# Altium schematic sheet motherboard.schdoc
size 309 x 223 mm; Symbol: Sheet-Symbol_A4; Device: Sheet-Symbol_A4; @Page Name: P1; @Create Date: 2022-10-26; @Page Count: 1; @Page No: 1; @Project Name: CO21; @Schematic Name: Schematic2; @Update Date: 2022-11-01; Company: 大连佳显-辉哥; Page Size: A4; Version: V1.0
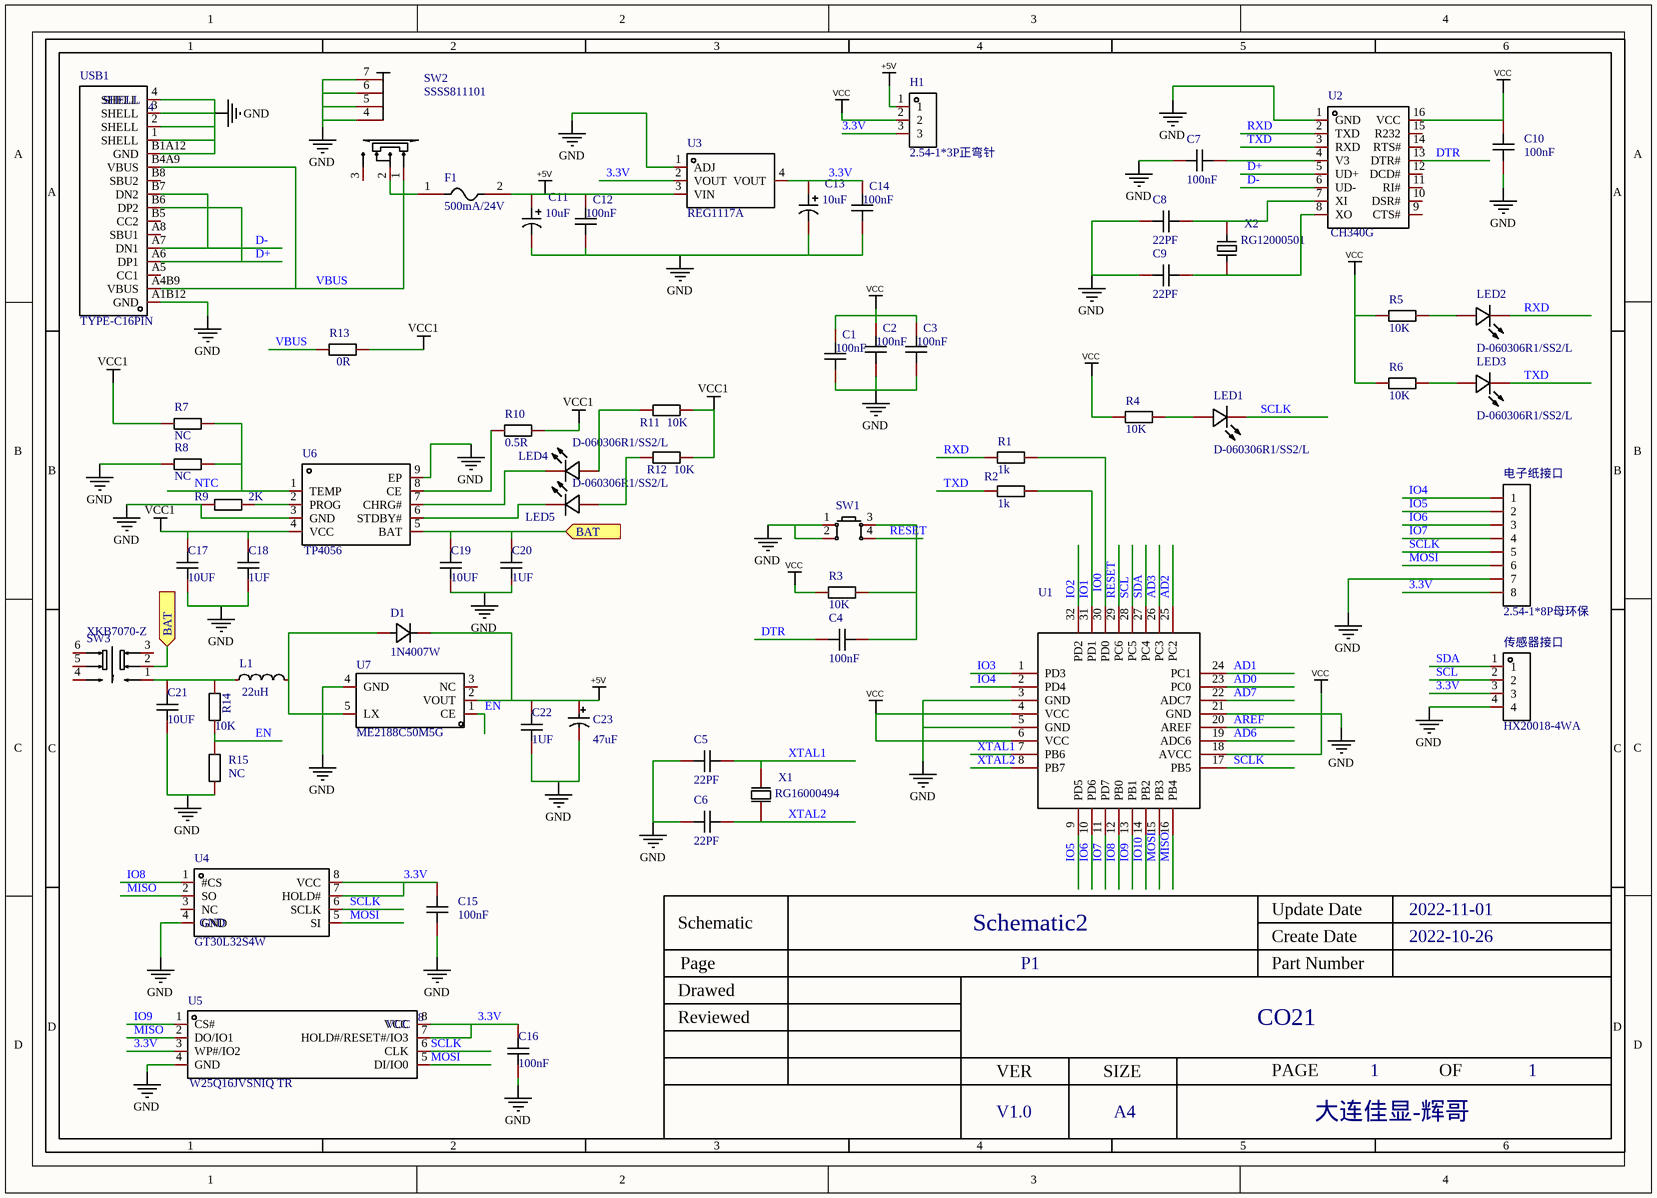
[diagram p0: motherboard.schdoc]

## Parts
C1  100nF  [C0603]
C2  100nF  [C0603]
C3  100nF  [C0603]
C4  100nF  [C0603]
C5  22PF  [C0603]
C6  22PF  [C0603]
C7  100nF  [C0603]
C8  22PF  [C0603]
C9  22PF  [C0603]
C10  100nF  [C0603]
C11  10uF  [CAP-SMD_L3.5-W2.8-FD]
C12  100nF  [C0603]
C13  10uF  [CAP-SMD_L3.5-W2.8-FD]
C14  100nF  [C0603]
C15  100nF  [C0603]
C16  100nF  [C0603]
C17  10UF  [C0603]
C18  1UF  [C0603]
C19  10UF  [C0603]
C20  1UF  [C0603]
C21  10UF  [C0603]
C22  1UF  [C0603]
C23  47uF  [CAP-TH_BD4.0-P1.50-D0.8-FD]
D1  1N4007W  [SOD-123FL_L3.0-W1.8-LS3.7-RD]
F1  500mA/24V  [F1206]
H1  2.54-1*3P正弯针  [HDR-TH_3P-P2.54-H-M-BW7.2-P]
L1  22uH  [IND-SMD_L5.0-W5.0-P3.60_SMNR5040]
LED1  D-060306R1/SS2/L  [LED0603-RD]
LED2  D-060306R1/SS2/L  [LED0603-RD]
LED3  D-060306R1/SS2/L  [LED0603-RD]
LED4  D-060306R1/SS2/L  [LED0603-RD]
LED5  D-060306R1/SS2/L  [LED0603-RD]
R1  1k  [R0603]
R2  1k  [R0603]
R3  10K  [R0603]
R4  10K  [R0603]
R5  10K  [R0603]
R6  10K  [R0603]
R7  NC  [R0603]
R8  NC  [R0603]
R9  2K  [R0603]
R10  0.5R  [R0603]
R11  10K  [R0603]
R12  10K  [R0603]
R13  0R  [R0603]
R14  10K  [R0603]
R15  NC  [R0603]
SW1  Key_SMD_6x6x6.5  [SW-SMD_4P-L6.0-W6.0-P4.50-LS9.0-2]  (value not drawn)
SW2  SSSS811101  [SW-SMD_SSSS811101]
SW3  XKB7070-Z  [SW-TH_6P-L7.0-W7.0-P2.00]
U1  EGA328p  (value not drawn)
U2  CH340G  [SOIC-16_L9.9-W3.9-P1.27-LS6.0-BL]
U3  REG1117A  [SOT-223-4_L6.5-W3.5-P2.30-LS7.0-BR]
U4  NAME: GND  [SOP-8_L5.3-W5.3-P1.27-LS8.0-BL]  (hidden comment: GT30L32S4W)
U5  NAME: VCC  NUMBER: 8  [SOIC-8_L5.2-W5.2-P1.27-LS7.9-BL]  (hidden comment: W25Q16JVSNIQ TR)
U6  TP4056  [ESOP-8_L4.9-W3.9-P1.27-LS6.0-BL-EP]
U7  ME2188C50M5G  [SOT-23-5_L3.0-W1.7-P0.95-LS2.8-BR]
USB1  NUMBER: 4  NAME: SHELL  [USB-C-SMD_TYPE-C16PIN]  (hidden comment: TYPE-C16PIN)
X1  RG16000494  [CRYSTAL-SMD_L5.0-W3.2]
X2  RG12000501  [CRYSTAL-SMD_L5.0-W3.2]
传感器接口  HX20018-4WA  [CONN-TH_4P-P2.00_HX20018-4WA]
电子纸接口  2.54-1*8P母环保  [HDR-TH_8P-P2.54-V-F-1]

## Ports
BAT (in)

## Nets
+5V: C11.1 C12.2 C22.1 C23.1 D1.1(K) F1.2 H1.1 U3.3(VIN) U7.2(VOUT)
GND: C1.1 C2.1 C3.1 C5.2 C6.2 C7.1 C8.2 C9.2 C10.1 C11.2 C12.1 C13.2 C14.1 C15.2 C16.2 C17.2 C18.2 C19.2 C20.2 C21.2 C22.2 C23.2 R8.1 R9.1 R15.1 SW1.1 SW1.2 SW2.4 SW2.5 SW2.6 SW2.7 U1.3(GND) U1.5(GND) U1.21(GND) U2.1(GND) U3.1(ADJ) U4.4(GND) U5.4(GND) U6.3(GND) U6.9(EP) U7.4(GND) USB1.1(SHELL) USB1.2(SHELL) USB1.3(SHELL) USB1.4(SHELL) USB1.A1B12(GND) USB1.B1A12(GND) 传感器接口.4 电子纸接口.7
VCC: C1.2 C2.2 C3.2 C10.2 H1.2 R3.1 R4.1 R5.1 R6.1 U1.4(VCC) U1.6(VCC) U1.18(AVCC) U2.16(VCC)
VCC1: C17.1 C18.1 R7.1 R10.2 R11.2 R12.2 R13.2 U6.4(VCC)
3.3V: C13.1 C14.2 C15.1 C16.1 H1.3 U3.2(VOUT) U3.4(VOUT) U4.7(HOLD#) U4.8(VCC) U5.3(WP#/IO2) U5.7(HOLD#/RESET#/IO3) U5.8(VCC) 传感器接口.3 电子纸接口.8
AD0: U1.23(PC0)
AD1: U1.24(PC1)
AD2: U1.25(PC2)
AD3: U1.26(PC3)
AD6: U1.19(ADC6)
AD7: U1.22(ADC7)
AREF: U1.20(AREF)
BAT: C19.1 C20.1 SW3.2 U6.5(BAT) ; port BAT
D+: U2.5(UD+) USB1.A6(DP1) USB1.B6(DP2)
D-: U2.6(UD-) USB1.A7(DN1) USB1.B7(DN2)
DTR: C4.2 U2.13(DTR#)
EN: R14.1 R15.2 U7.1(CE)
IO0: R1.2 U1.30(PD0)
IO1: R2.2 U1.31(PD1)
IO2: U1.32(PD2)
IO3: U1.1(PD3)
IO4: U1.2(PD4) 电子纸接口.1
IO5: U1.9(PD5) 电子纸接口.2
IO6: U1.10(PD6) 电子纸接口.3
IO7: U1.11(PD7) 电子纸接口.4
IO8: U1.12(PB0) U4.1(#CS)
IO9: U1.13(PB1) U5.1(CS#)
IO10: U1.14(PB2)
MISO: U1.16(PB4) U4.2(SO) U5.2(DO/IO1)
MOSI: U1.15(PB3) U4.5(SI) U5.5(DI/IO0) 电子纸接口.6
NTC: R7.2 R8.2 U6.1(TEMP)
RESET: C4.1 R3.2 SW1.3 SW1.4 U1.29(PC6)
RXD: LED2.1(-) R1.1 U2.2(TXD)
SCL: U1.28(PC5) 传感器接口.2
SCLK: LED1.1(-) U1.17(PB5) U4.6(SCLK) U5.6(CLK) 电子纸接口.5
SDA: U1.27(PC4) 传感器接口.1
TXD: LED3.1(-) R2.1 U2.3(RXD)
VBUS: R13.1 SW2.1 USB1.A4B9(VBUS) USB1.B4A9(VBUS)
XTAL1: C5.1 U1.7(PB6) X1.2(OSC2)
XTAL2: C6.1 U1.8(PB7) X1.1(OSC1)
NetC7_2: C7.2 U2.4(V3)
NetC8_1: C8.1 U2.7(XI) X2.2
NetC9_1: C9.1 U2.8(XO) X2.1
NetC21_1: C21.1 L1.1 R14.2 SW3.1
NetD1_2: D1.2(A) L1.2 U7.5(LX)
NetF1_1: F1.1 SW2.2
NetLED1_2: LED1.2(+) R4.2
NetLED2_2: LED2.2(+) R5.2
NetLED3_2: LED3.2(+) R6.2
NetLED4_1: LED4.1(-) U6.7(CHRG#)
NetLED4_2: LED4.2(+) R11.1
NetLED5_1: LED5.1(-) U6.6(STDBY#)
NetLED5_2: LED5.2(+) R12.1
NetR9_2: R9.2 U6.2(PROG)
NetR10_1: R10.1 U6.8(CE)

Not connected (* = marked no-connect by the designer): SW2 3; SW3 3 4 5 6; U2 9(CTS#) 10(DSR#) 11(RI#) 12(DCD#) 14(RTS#) 15(R232); U4 3(NC); U7 3(NC); USB1 A5(CC1) A8(SBU1) B5(CC2) B8(SBU2)

## Notes on the sheet
- 1
- 2
- 3
- 4
- 5
- 6
- A
- B
- C
- Schematic
- Schematic2
- Create Date
- Update Date
- 2022-10-26
- 2022-11-01
- Reviewed
- Drawed
- Page
- P1
- Part Number
- CO21
- D
- VER
- SIZE
- PAGE
- OF
- V1.0
- A4
- 大连佳显-辉哥

## Library data of the parts
C1-C4 C7 C10 C12 C14-C16 = CAP_0603: Symbol: C1210X7R475K630NT; Convert to PCB: yes; Name: 100nF; Device: CAP_0603; Add into BOM: yes; Supplier Footprint: 0603; Value: 100nF
C5 C6 C8 C9 C17-C22 = CAP_0603: Symbol: C1210X7R475K630NT; Convert to PCB: yes; Value: 100nF; Device: CAP_0603; Add into BOM: yes; Supplier Footprint: 0603
  C5 C6 C8 C9: Name: 22PF
  C17 C19 C21: Name: 10UF
  C18 C20 C22: Name: 1UF
C11 C13 = CA45A-B-20V-10UF-K: 容值:10uF;精度:±10%;额定电压:20V;工作温度:-55~+125;; Manufacturer: CEC(振华新云); Add into BOM: yes; Tolerance: ±10%; Rated Voltage: 20V; Name: 10uF; Symbol: CA45A-B-20V-10UF-K; Device: CA45A-B-20V-10UF-K; LCSC Part Name: 10uF ±10% 20V; Supplier Part: C2976904; Manufacturer Part: CA45A-B-20V-10UF-K; Supplier Footprint: SMD,3.5x2.8x1.9mm; JLCPCB Part Class: Extended Part; Datasheet: https://atta.szlcsc.com/upload/public/pdf/source/20220222/C2C5F368BEBB90E653B4407F98E5644A.pdf; Supplier: LCSC; Convert to PCB: yes; Value: 10uF; Operating Temperature: -55~+125
C23 = KF476M010C05RR0VH2FP0: 容值:47uF;精度:±20%;额定电压:10V;电容体直径:4mm;电容体长度:5mm;脚间距:1.5mm;工作寿命:1000hrs@105;; Manufacturer: CX(承兴); Symbol: 47uF 10V 4*5; Add into BOM: yes; Tolerance: ±20%; Rated Voltage: 10V; φD: 4mm; L: 5mm; Name: 47uF; Device: KF476M010C05RR0VH2FP0; LCSC Part Name: 47uF ±20% 10V; Supplier Part: C43312; Manufacturer Part: KF476M010C05RR0VH2FP0; Supplier Footprint: 径向引线,4x5mm; JLCPCB Part Class: Extended Part; Datasheet: https://atta.szlcsc.com/upload/public/pdf/source/20211027/683CDB832DC6AB6D763A974A6CD8736B.pdf; Supplier: LCSC; Convert to PCB: yes; Value: 47uF; Lead Spacing: 1.5mm; Lifetime @ Temp: 1000hrs@105
D1 = 1N4007W_C725740: 二极管配置:独立式;直流反向耐压(Vr):1kV;平均整流电流(Io):1A;正向压降(Vf):1.1V@1A;反向电流(Ir):5A@1kV;; Manufacturer: ST(先科); Add into BOM: yes; Diode Configuration: 独立式; Reverse Voltage (Vr): 1kV; Average Rectified Current (Io): 1A; Reverse Leakage Current: 5A@1kV; Name: 1N4007W; Symbol: 1N4007W_C725740; Device: 1N4007W_C725740; LCSC Part Name: 1kV 1A 1.1V@1A; Supplier Part: C725740; Manufacturer Part: 1N4007W; Supplier Footprint: SOD-123FL; JLCPCB Part Class: Extended Part; Datasheet: https://atta.szlcsc.com/upload/public/pdf/source/20200819/C725740_1A6111DD6A6C076E74995BF1D101A939.pdf; Supplier: LCSC; Convert to PCB: yes; Forward Voltage (Vf@If): 1.1V@1A
F1 = 500mA/24V: 最大电压:24V;最大电流:40A;保持电流:500mA;跳闸电流:1A;消耗功率:600mW;初始态阻值(最小值):150mΩ;跳断后阻值(最大值):700mΩ;最大动作时间:100ms;工作温度:-;; Manufacturer: DOWO(东沃); Add into BOM: yes; Operating Voltage (Max): 24V; Current Rating (Max): 40A; Hold Current: 500mA; Trip Current: 1A; Power Dissipation: 600mW; Resistance - Initial (Ri) (Min): 150mΩ; Resistance - Post Trip (R1) (Max): 700mΩ; Maximum Time to Trip: 100ms; Name: 500mA/24V; Symbol: 500MA/24V; Device: 500mA/24V; LCSC Part Name: 500mA/24V; Supplier Part: C2984676; Manufacturer Part: 500mA/24V; Supplier Footprint: 1206; JLCPCB Part Class: Extended Part; Datasheet: https://atta.szlcsc.com/upload/public/pdf/source/20220324/2CE2C6DFFF7F8A3F73404C8EC45CB317.pdf; Supplier: LCSC; Convert to PCB: yes; Operating Temperature: -
H1 = 2.54-1*3P正弯针: 间距:2.54mm;总PIN位数:3;排数:1;插针结构:1x3P;行距:-;安装类型:弯插;圆针/方针:方针;额定电流:3A;额定电压:-;配合针长度:3mm;塑高:2.54mm;端接针长度:-;触头材质:-;触头镀层:-;工作温度范围:-55~+105;颜色:黑色;; Manufacturer: BOOMELE(博穆精密); Symbol: C92159; Add into BOM: yes; Pitch: 2.54mm; Pin Structure: 1x3P; Circluar Pins/Square Pins: 方针; Current Rating (Max): 3A; Name: 2.54-1*3P正弯针; Device: 2.54-1*3P正弯针; LCSC Part Name: 2.54mm 1x3P 弯插 方针; Supplier Part: C92159; Manufacturer Part: 2.54-1*3P正弯针; Supplier Footprint: 插件,P=2.54mm; JLCPCB Part Class: Extended Part; Datasheet: https://atta.szlcsc.com/upload/public/pdf/source/20181121/C2334_B051029C4931EB562F9DCCAAD18AC88A.pdf; Supplier: LCSC; Convert to PCB: yes; Number of Pins: 3; Number of Rows: 1; Row Spacing: -; Mounting Type: 弯插; Voltage Rating (Max): -; Length of Mating Pin: 3mm; Insulation Height: 2.54mm; Length of End Connection Pin: -; Contact Material: -; Contact Plating: -; Operating Temperature Range: -55~+105; Color: 黑色
L1 = SMNR5040-220MT: 电感值:22uH;精度:±20%;额定电流:1.4A;直流电阻(DCR):174mΩ;; Manufacturer: SXN(顺翔诺); Add into BOM: yes; Tolerance: ±20%; Rated Current: 1.4A; DC Resistance (DCR): 174mΩ; Name: 22uH; Symbol: SMNR5040-220MT; Device: SMNR5040-220MT; LCSC Part Name: 22uH ±20% 1.4A 174mΩ; Supplier Part: C9391; Manufacturer Part: SMNR5040-220MT; Supplier Footprint: SMD; JLCPCB Part Class: Extended Part; Datasheet: https://atta.szlcsc.com/upload/public/pdf/source/20210810/8C07D4BA256EC9B57FF3FBBF0FDAC34D.pdf; Supplier: LCSC; Convert to PCB: yes; Value: 22uH
LED1-LED5 = D-060306R1/SS2/L: 发光颜色:红灯;; Manufacturer: 方舟 ARKLED; Symbol: D-R060306L3-KS2; Add into BOM: yes; Emitted Color: 红灯; Name: D-060306R1/SS2/L; Device: D-060306R1/SS2/L; LCSC Part Name: D-R060306L3-KS2 高亮红; Supplier Part: C118330; Manufacturer Part: D-060306R1/SS2/L; Supplier Footprint: 0603; JLCPCB Part Class: Extended Part; Datasheet: https://atta.szlcsc.com/upload/public/pdf/source/20170925/C118330_1506321367724990123.pdf; Supplier: LCSC; Convert to PCB: yes
R1 R2 R7-R10 R13 R15 = Res_0603: Symbol: 电阻; Convert to PCB: yes; Value: 10K; Device: Res_0603; Add into BOM: yes; Supplier Footprint: 0603
  R1 R2: Name: 1k
  R7 R8 R15: Name: NC
  R9: Name: 2K
  R10: Name: 0.5R
  R13: Name: 0R
R3-R6 R11 R12 R14 = Res_0603: Symbol: 电阻; Convert to PCB: yes; Name: 10K; Device: Res_0603; Add into BOM: yes; Supplier Footprint: 0603; Value: 10K
SW1 = Key_SMD_6x6x6.5: 触点电流:50mA;额定电压(DC):12V;电路结构:单刀单掷;安装方式:立贴;按钮形状:圆形按钮;带灯:-;开关长度:6mm;开关宽度:6mm;开关高度:6.5mm;; Symbol: 轻触按键; Convert to PCB: yes; Device: Key_SMD_6x6x6.5; Add into BOM: yes; Supplier Part: C455113; Supplier Footprint: SMD; JLCPCB Part Class: Extended Part
SW2 = SSSS811101: 额定电流(DC):300mA;额定电压(DC):5V;额定电流(AC):-;额定电压(AC):-;电路结构:单刀双掷;安装方式:卧贴;机械寿命:10000;滑钮形状:矩形柱状;引脚样式:SMD接片;工作温度:-40~+85;开关高度:4.1mm;; Manufacturer: ALPSALPINE(阿尔卑斯阿尔派); Add into BOM: yes; Current Rating (DC): 300mA; Voltage Rating (DC): 5V; Circuit: 单刀双掷; Mechanical Life: 10000; Actuator Style: 矩形柱状; Pin Style: SMD接片; Switch Height: 4.1mm; Name: SSSS811101; Symbol: SSSS811101; Device: SSSS811101; LCSC Part Name: SSSS811101; Supplier Part: C109335; Manufacturer Part: SSSS811101; Supplier Footprint: SMD; JLCPCB Part Class: Extended Part; Datasheet: https://atta.szlcsc.com/upload/public/pdf/source/20170620/1497944730069.pdf; Supplier: LCSC; Convert to PCB: yes; Current Rating (AC): -; Voltage Rating (AC): -; Mounting Style: 卧贴; Operating Temperature: -40~+85
SW3 = XKB7070-Z: 触点电流:100mA;额定电压 (AC):250V;额定电压 (DC):30V;绝缘电阻:100MΩ;安装方式:直插;自锁/无锁:自锁;按键形状:矩形按钮;按键/盖帽颜色:蓝色;带灯:无;引脚样式:PC引脚;作用力:160gf@±80gf;防护等级:-;工作温度:-15~+55;机械寿命:100000;; Manufacturer: XKB Connectivity(中国星坤); Add into BOM: yes; Contact Current: 100mA; Voltage Rating (AC): 250V; Voltage Rating (DC): 30V; Insulation Resistance: 100MΩ; Self Lock / No Lock: 自锁; Actuator Style: 矩形按钮; Actuator/Cap Color: 蓝色; With Lamp: 无; Pin Style: PC引脚; Mechanical Life: 100000; Name: XKB7070-Z; Symbol: XKB7070-Z; Device: XKB7070-Z; LCSC Part Name: 按键开关   7*7插件自锁 蓝白黑; Supplier Part: C318863; Manufacturer Part: XKB7070-Z; Supplier Footprint: 插件; JLCPCB Part Class: Extended Part; Datasheet: https://atta.szlcsc.com/upload/public/pdf/source/20211015/75A682A27A424BDE8D93C2CFA14C38FE.pdf; Supplier: LCSC; Convert to PCB: yes; Mounting Style: 直插; Operating Force: 160gf@±80gf; IP Rating: -; Operating Temperature: -15~+55
U1 = EGA328p: Add into BOM: yes; Symbol: EGA328p; Device: EGA328p; Convert to PCB: yes
U2 = CH340G: 类型:Transceiver;协议类别:USB 2.0;驱动器/接收器数:-;数据速率:2Mbps;; Manufacturer: WCH(南京沁恒); Add into BOM: yes; Protocol: USB 2.0; Data Rate: 2Mbps; Supply Voltage: 3.3V, 5V; Name: CH340G; Symbol: CH340G; Device: CH340G; LCSC Part Name: CH340G; Supplier Part: C14267; Manufacturer Part: CH340G; Supplier Footprint: SOP-16_150mil; JLCPCB Part Class: Extended Part; Datasheet: https://atta.szlcsc.com/upload/public/pdf/source/20200819/C14267_9F0B4B8160AEBA86F3219E64956E4601.pdf; Supplier: LCSC; Convert to PCB: yes; Type: Transceiver; Number of Drivers/Receivers: -
U3 = REG1117A: Manufacturer: TI(德州仪器); Add into BOM: yes; Name: REG1117A; Symbol: REG1117A; Device: REG1117A; LCSC Part Name: REG1117A; Supplier Part: C2869046; Manufacturer Part: REG1117A; Supplier Footprint: SOT-223-4; JLCPCB Part Class: Extended Part; Supplier: LCSC; Convert to PCB: yes
U4 = GT30L32S4W: 字符集:-;点阵大小:-;时钟频率:-;工作温度:-;; Manufacturer: GENITOP(高通); Add into BOM: yes; Name: GT30L32S4W; Symbol: GT30L32S4W; Device: GT30L32S4W; LCSC Part Name: GT30L32S4W; Supplier Part: C97325; Manufacturer Part: GT30L32S4W; Supplier Footprint: SOP-8_208mil; JLCPCB Part Class: Extended Part; Datasheet: https://atta.szlcsc.com/upload/public/pdf/source/20220321/FF487C540DB634E6E3B2751B1DD3D486.pdf; Supplier: LCSC; Convert to PCB: yes; Character Set: -; Dot Pitch: -; Clock Rate: -; Operating Temperature Range: -
U5 = W25Q16JVSNIQ TR: Manufacturer: WINBOND(华邦); Add into BOM: yes; Name: W25Q16JVSNIQ TR; Symbol: W25Q16JVSNIQ TR; Device: W25Q16JVSNIQ TR; LCSC Part Name: W25Q16JVSNIQ TR; Supplier Part: C2456211; Manufacturer Part: W25Q16JVSNIQ TR; Supplier Footprint: SOIC-8; JLCPCB Part Class: Extended Part; Datasheet: https://atta.szlcsc.com/upload/public/pdf/source/20190529/C115407_78E5B4F96E7138D299EC51EC5982A1A5.pdf; Supplier: LCSC; Convert to PCB: yes
U6 = TP4056_C725790: Manufacturer: UMW(友台半导体); Add into BOM: yes; Name: TP4056; Symbol: TP4056_C725790; Device: TP4056_C725790; LCSC Part Name: TP4056; Supplier Part: C725790; Manufacturer Part: TP4056; Supplier Footprint: ESOP-8; JLCPCB Part Class: Extended Part; Datasheet: https://atta.szlcsc.com/upload/public/pdf/source/20211011/37515E71BA298E23D23475482C49633D.pdf; Supplier: LCSC; Convert to PCB: yes
U7 = ME2188C50M5G: 功能类型:升压型;同步整流:是;输出通道数:1;拓扑结构:升压式;输入电压:0.9V~5V;输出电压:5V;输出电流(最大值):300mA;开关频率:320kHz;; Manufacturer: MICRONE(南京微盟); Add into BOM: yes; Function: 升压型; Synchronous Rectification: 是; Number of Outputs: 1; Topology: 升压式; Output Voltage: 5V; Output Current (Max): 300mA; Switching Frequency: 320kHz; Name: ME2188C50M5G; Symbol: ME2188C50M5G; Device: ME2188C50M5G; LCSC Part Name: 升压型 0.9V~5V 300mA 320kHz; Supplier Part: C236768; Manufacturer Part: ME2188C50M5G; Supplier Footprint: SOT-23-5; JLCPCB Part Class: Extended Part; Datasheet: https://atta.szlcsc.com/upload/public/pdf/source/20180904/C236768_E7AD8C2FE568D006CA38E8CDC667E81C.pdf; Supplier: LCSC; Convert to PCB: yes; Input Voltage: 0.9V~5V
USB1 = TYPE-C16PIN: 连接器类型:Type-C;标准:-;公母:母座;触点数量:16;端口数量:1;安装方式:卧贴;额定电流 - 电源:3A;工作温度范围:-40~+85;; Manufacturer: SHOU HAN(首韩); Add into BOM: yes; Connector Type: Type-C; Gender: 母座; Number of Contacts: 16; Number of Ports: 1; Current Rating - Power (Max): 3A; Name: TYPE-C16PIN; Symbol: TYPE-C16PIN; Device: TYPE-C16PIN; LCSC Part Name: Type-C 母座 卧贴 停产 快充闪充 停产; Supplier Part: C393939; Manufacturer Part: TYPE-C16PIN; Supplier Footprint: SMD; JLCPCB Part Class: Extended Part; Datasheet: https://atta.szlcsc.com/upload/public/pdf/source/20190521/C393939_7B9043D4CF1026AF443AB60D91FBCD5C.pdf; Supplier: LCSC; Convert to PCB: yes; Standard: -; Mounting Style: 卧贴; Operating Temperature Range: -40~+85
X1 = RG16000494: GLASS5032-2P; Manufacturer: TROQ(创捷); Add into BOM: yes; Name: RG16000494; Symbol: RG16000494; Device: RG16000494; LCSC Part Name: 16M 20PF +-20PPM 70Ω; Supplier Part: C2929410; Manufacturer Part: RG16000494; Supplier Footprint: SMD5032-2P; JLCPCB Part Class: Extended Part; Datasheet: https://atta.szlcsc.com/upload/public/pdf/source/20211222/D9598735268095AC127417D007DA28F4.pdf; Supplier: LCSC; Convert to PCB: yes
X2 = RG12000501: GLASS5032-2P; Manufacturer: TROQ(创捷); Add into BOM: yes; Name: RG12000501; Symbol: RG12000501; Device: RG12000501; LCSC Part Name: 12M 20PF +-20PPM 80Ω; Supplier Part: C2929408; Manufacturer Part: RG12000501; Supplier Footprint: SMD5032-2P; JLCPCB Part Class: Extended Part; Datasheet: https://atta.szlcsc.com/upload/public/pdf/source/20211222/D0ED47F2D28101903B869BE55665BC61.pdf; Supplier: LCSC; Convert to PCB: yes
传感器接口 = HX20018-4WA: 参考系列:-;间距:2mm;插针结构:1x4P;排数:1;每排PIN数:4;行距:-;公母:公型插针;安装方式:弯插;额定电流:3A;工作温度范围:-25~+85;; Manufacturer: HX(红星); Add into BOM: yes; Pitch: 2mm; Pins Structure: 1x4P; Number of PINs Per Row: 4; Gender: 公型插针; Current Rating (Max): 3A; Name: HX20018-4WA; Symbol: HX20018-4WA; Device: HX20018-4WA; LCSC Part Name: 间距2.0mm 弯插 弯针 4PIN位 带扣 白色 卧式插座 间 弯插 弯针 4PIN位 带扣 白色 卧式插座; Supplier Part: C469818; Manufacturer Part: HX20018-4WA; Supplier Footprint: 插件,P=2mm; JLCPCB Part Class: Extended Part; Datasheet: https://atta.szlcsc.com/upload/public/pdf/source/20191217/C469818_25BBB35CD087F753CC25FAA0F810B1D8.pdf; Supplier: LCSC; Convert to PCB: yes; Reference Series: -; Number of Rows: 1; Row Spacing: -; Mounting Style: 弯插; Operating Temperature Range: -25~+85
电子纸接口 = 2.54-1*8P母环保: 间距:2.54mm;总孔位数:8;排数:1;插孔结构:1x8P;行距:-;安装类型:直插;塑高:-;触头材质:-;触头镀层:-;; Manufacturer: BOOMELE(博穆精密); Symbol: Header-Female-2.54_1x8; Add into BOM: yes; Pitch: 2.54mm; Number of Holes: 8; Holes Structure: 1x8P; Name: 2.54-1*8P母环保; Device: 2.54-1*8P母环保; LCSC Part Name: 2.54mm 1x8P; Supplier Part: C27438; Manufacturer Part: 2.54-1*8P母环保; Supplier Footprint: 直插,P=2.54mm; JLCPCB Part Class: Extended Part; Datasheet: https://atta.szlcsc.com/upload/public/pdf/source/20151109/1457707554453.pdf; Supplier: LCSC; Convert to PCB: yes; Number of Rows: 1; Row Spacing: -; Mounting Type: 直插; Insulation Height: -; Contact Material: -; Contact Plating: -